# EAGLE design 1a (EAGLE 6.4)
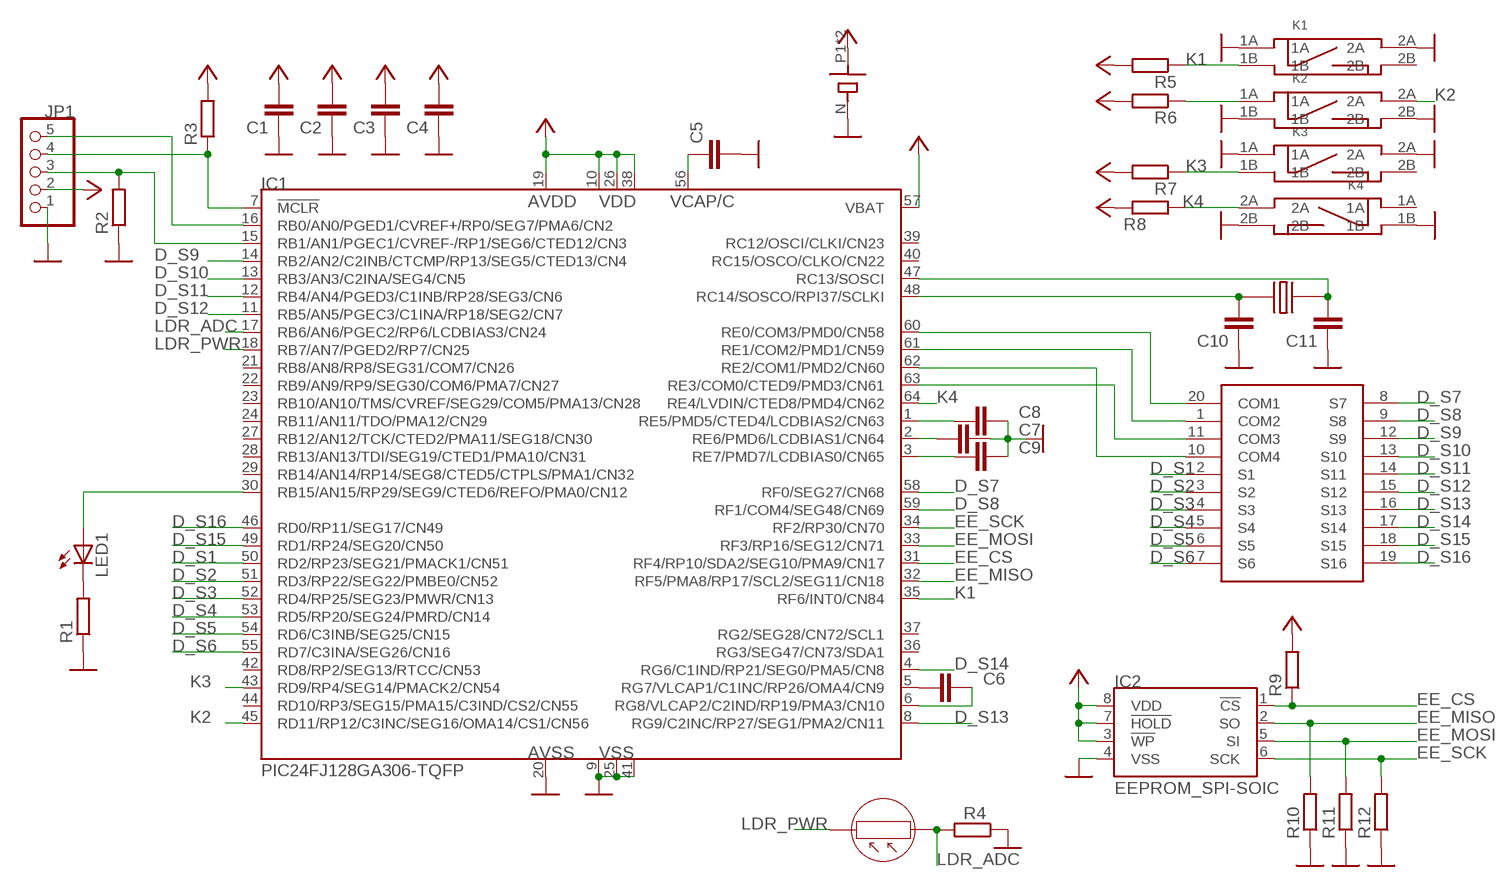
[diagram p0: schematic, sheet 1]

## Parts
C1  C_1206  [R1206]
C2  C_0603  [0603]
C3  C_0603  [0603]
C4  C_0603  [0603]
C5  C_0603  [0603]
C6  C_0603  [0603]
C7  C_0603  [0603]
C8  C_0603  [0603]
C9  C_0603  [0603]
C10  C_0603  [0603]
C11  C_0603  [0603]
IC1  PIC24FJ128GA306-TQFP  [TQFP64-10X10]
IC2  EEPROM_SPI-SOIC  [SO-08]
JP1  PINHD-1X05_2.00  [1X05M]
K1  SWITCH_BD_B  [SW_SMD2]
K2  SWITCH_BD_B  [SW_SMD2]
K3  SWITCH_BD_B  [SW_SMD2]
K4  SWITCH_BD_B  [SW_SMD2]
LCD1  LCD_DE188  [LCD_DE188]
LDR1  LDR  [LDR_5]
LED1  LEDCHIPLED_0805  [CHIPLED_0805]
R1  R_0603  [0603]
R2  R_0603  [0603]
R3  R_0603  [0603]
R4  R_0603  [0603]
R5  R_0603  [0603]
R6  R_0603  [0603]
R7  R_0603  [0603]
R8  R_0603  [0603]
R9  R_0603  [0603]
R10  R_0603  [0603]
R11  R_0603  [0603]
R12  R_0603  [0603]
U$1  BATTK3002  [BATT_KEYS3002]
X1  CRYST_TC26MC146  [CRYST_MC146]

## Nets
D_S1: IC1.50(RD2/RP23/SEG21/PMACK1/CN51) LCD1.2(S1)
D_S2: IC1.51(RD3/RP22/SEG22/PMBE0/CN52) LCD1.3(S2)
D_S3: IC1.52(RD4/RP25/SEG23/PMWR/CN13) LCD1.4(S3)
D_S4: IC1.53(RD5/RP20/SEG24/PMRD/CN14) LCD1.5(S4)
D_S5: IC1.54(RD6/C3INB/SEG25/CN15) LCD1.6(S5)
D_S6: IC1.55(RD7/C3INA/SEG26/CN16) LCD1.7(S6)
D_S7: IC1.58(RF0/SEG27/CN68) LCD1.8(S7)
D_S8: IC1.59(RF1/COM4/SEG48/CN69) LCD1.9(S8)
D_S9: IC1.14(RB2/AN2/C2INB/CTCMP/RP13/SEG5/CTED13/CN4) LCD1.12(S9)
D_S10: IC1.13(RB3/AN3/C2INA/SEG4/CN5) LCD1.13(S10)
D_S11: IC1.12(RB4/AN4/PGED3/C1INB/RP28/SEG3/CN6) LCD1.14(S11)
D_S12: IC1.11(RB5/AN5/PGEC3/C1INA/RP18/SEG2/CN7) LCD1.15(S12)
D_S13: IC1.8(RG9/C2INC/RP27/SEG1/PMA2/CN11) LCD1.16(S13)
D_S14: IC1.4(RG6/C1IND/RP21/SEG0/PMA5/CN8) LCD1.17(S14)
D_S15: IC1.49(RD1/RP24/SEG20/CN50) LCD1.18(S15)
D_S16: IC1.46(RD0/RP11/SEG17/CN49) LCD1.19(S16)
EE_CS: IC1.31(RF4/RP10/SDA2/SEG10/PMA9/CN17) IC2.1(!CS) R9.1
EE_MISO: IC1.32(RF5/PMA8/RP17/SCL2/SEG11/CN18) IC2.2(SO) R10.2
EE_MOSI: IC1.33(RF3/RP16/SEG12/CN71) IC2.5(SI) R11.2
EE_SCK: IC1.34(RF2/RP30/CN70) IC2.6(SCK) R12.2
GND: C1.1 C2.1 C3.1 C4.1 C5.2 C7.1 C8.1 C9.1 C10.1 C11.1 IC1.9(VSS) IC1.20(AVSS) IC1.25(VSS) IC1.41(VSS) IC2.4(VSS) JP1.1 K1.1A K1.2A K2.1B K2.2B K3.1A K3.2A K4.1B K4.2B R1.1 R2.1 R4.1 R10.1 R11.1 R12.1 U$1.N(M)
K1: IC1.35(RF6/INT0/CN84) K1.1B R5.1
K2: IC1.45(RD11/RP12/C3INC/SEG16/OMA14/CS1/CN56) K2.2A
K3: IC1.43(RD9/RP4/SEG14/PMACK2/CN54) K3.1B R7.1
K4: IC1.64(RE4/LVDIN/CTED8/PMD4/CN62) K4.2A R8.2
LDR_ADC: IC1.17(RB6/AN6/PGEC2/RP6/LCDBIAS3/CN24) LDR1.P$1 R4.2
LDR_PWR: IC1.18(RB7/AN7/PGED2/RP7/CN25) LDR1.P$2
N$5: C5.1 IC1.56(C)
N$6: C11.2 IC1.47(RC13/SOSCI) X1.1
N$7: C10.2 IC1.48(RC14/SOSCO/RPI37/SCLKI) X1.4
N$8: IC1.60(RE0/COM3/PMD0/CN58) LCD1.20(COM1)
N$9: IC1.61(RE1/COM2/PMD1/CN59) LCD1.1(COM2)
N$10: IC1.63(RE3/COM0/CTED9/PMD3/CN61) LCD1.11(COM3)
N$11: IC1.62(RE2/COM1/PMD2/CN60) LCD1.10(COM4)
N$12: C8.2 IC1.1(RE5/PMD5/CTED4/LCDBIAS2/CN63)
N$13: C7.2 IC1.2(RE6/PMD6/LCDBIAS1/CN64)
N$14: C9.2 IC1.3(RE7/PMD7/LCDBIAS0/CN65)
N$15: LED1.C R1.2
N$16: IC1.30(RB15/AN15/RP29/SEG9/CTED6/REFO/PMA0/CN12) LED1.A
N$17: K2.1A R6.1
N$31: C6.2 IC1.5(RG7/VLCAP1/C1INC/RP26/OMA4/CN9)
N$32: C6.1 IC1.6(RG8/VLCAP2/C2IND/RP19/PMA3/CN10)
N$33: IC1.15(RB1/AN1/PGEC1/CVREF-/RP1/SEG6/CTED12/CN3) JP1.3 R2.2
N$34: IC1.16(RB0/AN0/PGED1/CVREF+/RP0/SEG7/PMA6/CN2) JP1.5
N$35: IC1.7(!MCLR) JP1.4 R3.1
VCC: C1.2 C2.2 C3.2 C4.2 IC1.10(VDD) IC1.19(AVDD) IC1.26(VDD) IC1.38(VDD) IC1.57(VBAT) IC2.3(!WP) IC2.7(!HOLD) IC2.8(VDD) JP1.2 R3.2 R5.2 R6.2 R7.2 R8.1 R9.2 U$1.P1(P) U$1.P2(P)
Unconnected: IC1.21(RB8/AN8/RP8/SEG31/COM7/CN26) IC1.22(RB9/AN9/RP9/SEG30/COM6/PMA7/CN27) IC1.23(RB10/AN10/TMS/CVREF/SEG29/COM5/PMA13/CN28) IC1.24(RB11/AN11/TDO/PMA12/CN29) IC1.27(RB12/AN12/TCK/CTED2/PMA11/SEG18/CN30) IC1.28(RB13/AN13/TDI/SEG19/CTED1/PMA10/CN31) IC1.29(RB14/AN14/RP14/SEG8/CTED5/CTPLS/PMA1/CN32) IC1.36(RG3/SEG47/CN73/SDA1) IC1.37(RG2/SEG28/CN72/SCL1) IC1.39(RC12/OSCI/CLKI/CN23) IC1.40(RC15/OSCO/CLKO/CN22) IC1.42(RD8/RP2/SEG13/RTCC/CN53) IC1.44(RD10/RP3/SEG15/PMA15/C3IND/CS2/CN55) K1.2B K3.2B K4.1A

## Library data of the parts
C1-C11 = _moja:C
IC1 = _mcom6:PIC24FJ128GA306
IC2 = _mcom6:EEPROM_SPI
JP1 = pinhead-2:PINHD-1X05: PIN HEADER
K1-K4 = _moja:SWITCH_BD
LCD1 = _moja:LCD_DE188
LDR1 = _moja:LDR
LED1 = led:LED: LED OSRAM: - CHIPLED LG R971, LG N971, LY N971, LG Q971, LY Q971, LO R971, LY R971 LH N974, LH R974 LS Q976, LO Q976, LY Q976 LO Q996 - Hyper CHIPLED LW Q18S LB Q993, LB Q99A, LB R99A - SideLED LS A670, LO A670, LY A670, LG A670, LP A670 LB A673, LV A673, LT A673, LW A673 LH A674 LY A675 LS A676, LA A676, LO A676, LY A676, LW A676 LS A679, LY A679, LG A679 - Hyper Micro SIDELED® LS Y876, LA Y876, LO Y876, LY Y876 LT Y87S - SmartLED LW L88C, LW L88S LB L89C, LB L89S, LG L890 LS L89K, LO L89K, LY L89K LS L896, LA L896, LO L896, LY L896 - TOPLED LS T670, LO T670, LY T670, LG T670, LP T670 LSG T670, LSP T670, LSY T670, LOP T670, LYG T670 LG T671, LOG T671, LSG T671 LB T673, LV T673, LT T673, LW T673 LH T674 LS T676, LA T676, LO T676, LY T676, LB T676, LH T676, LSB T676, LW T676 LB T67C, LV T67C, LT T67C, LS T67K, LO T67K, LY T67K, LW E67C LS E67B, LA E67B, LO E67B, LY E67B, LB E67C, LV E67C, LT E67C LW T67C LS T679, LY T679, LG T679 LS T770, LO T770, LY T770, LG T770, LP T770 LB T773, LV T773, LT T773, LW T773 LH T774 LS E675, LA E675, LY E675, LS T675 LS T776, LA T776, LO T776, LY T776, LB T776 LHGB T686 LT T68C, LB T68C - Hyper Mini TOPLED® LB M676 - Mini TOPLED Santana® LG M470 LS M47K, LO M47K, LY M47K Source: http://www.osram.convergy.de LUXEON: - LUMILED® LXK2-PW12-R00, LXK2-PW12-S00, LXK2-PW14-U00, LXK2-PW14-V00 LXK2-PM12-R00, LXK2-PM12-S00, LXK2-PM14-U00 LXK2-PE12-Q00, LXK2-PE12-R00, LXK2-PE12-S00, LXK2-PE14-T00, LXK2-PE14-U00 LXK2-PB12-K00, LXK2-PB12-L00, LXK2-PB12-M00, LXK2-PB14-N00, LXK2-PB14-P00, LXK2-PB14-Q00 LXK2-PR12-L00, LXK2-PR12-M00, LXK2-PR14-Q00, LXK2-PR14-R00 LXK2-PD12-Q00, LXK2-PD12-R00, LXK2-PD12-S00 LXK2-PH12-R00, LXK2-PH12-S00 LXK2-PL12-P00, LXK2-PL12-Q00, LXK2-PL12-R00 Source: www.luxeon.com KINGBRIGHT: KA-3528ASYC Source: www.kingbright.com
R1-R12 = _moja:R
U$1 = _moja:BATT
X1 = _moja:CRYST_TC26

## Board
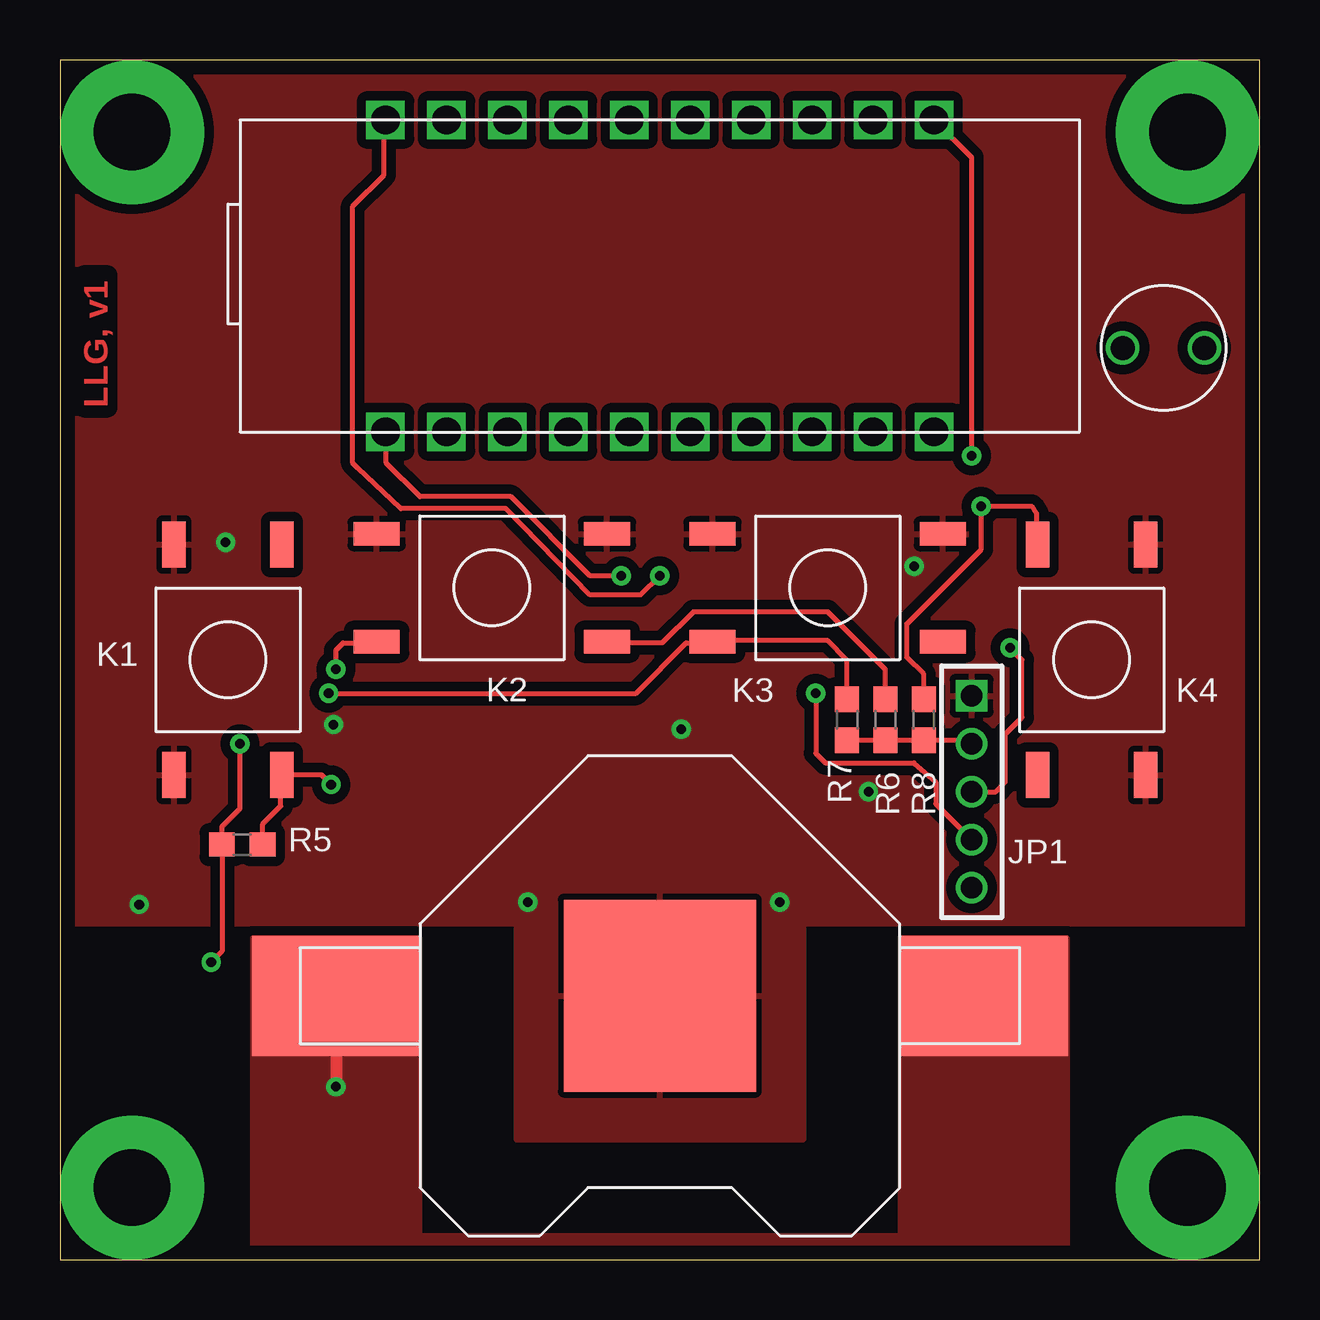
[diagram p1: board, top side]
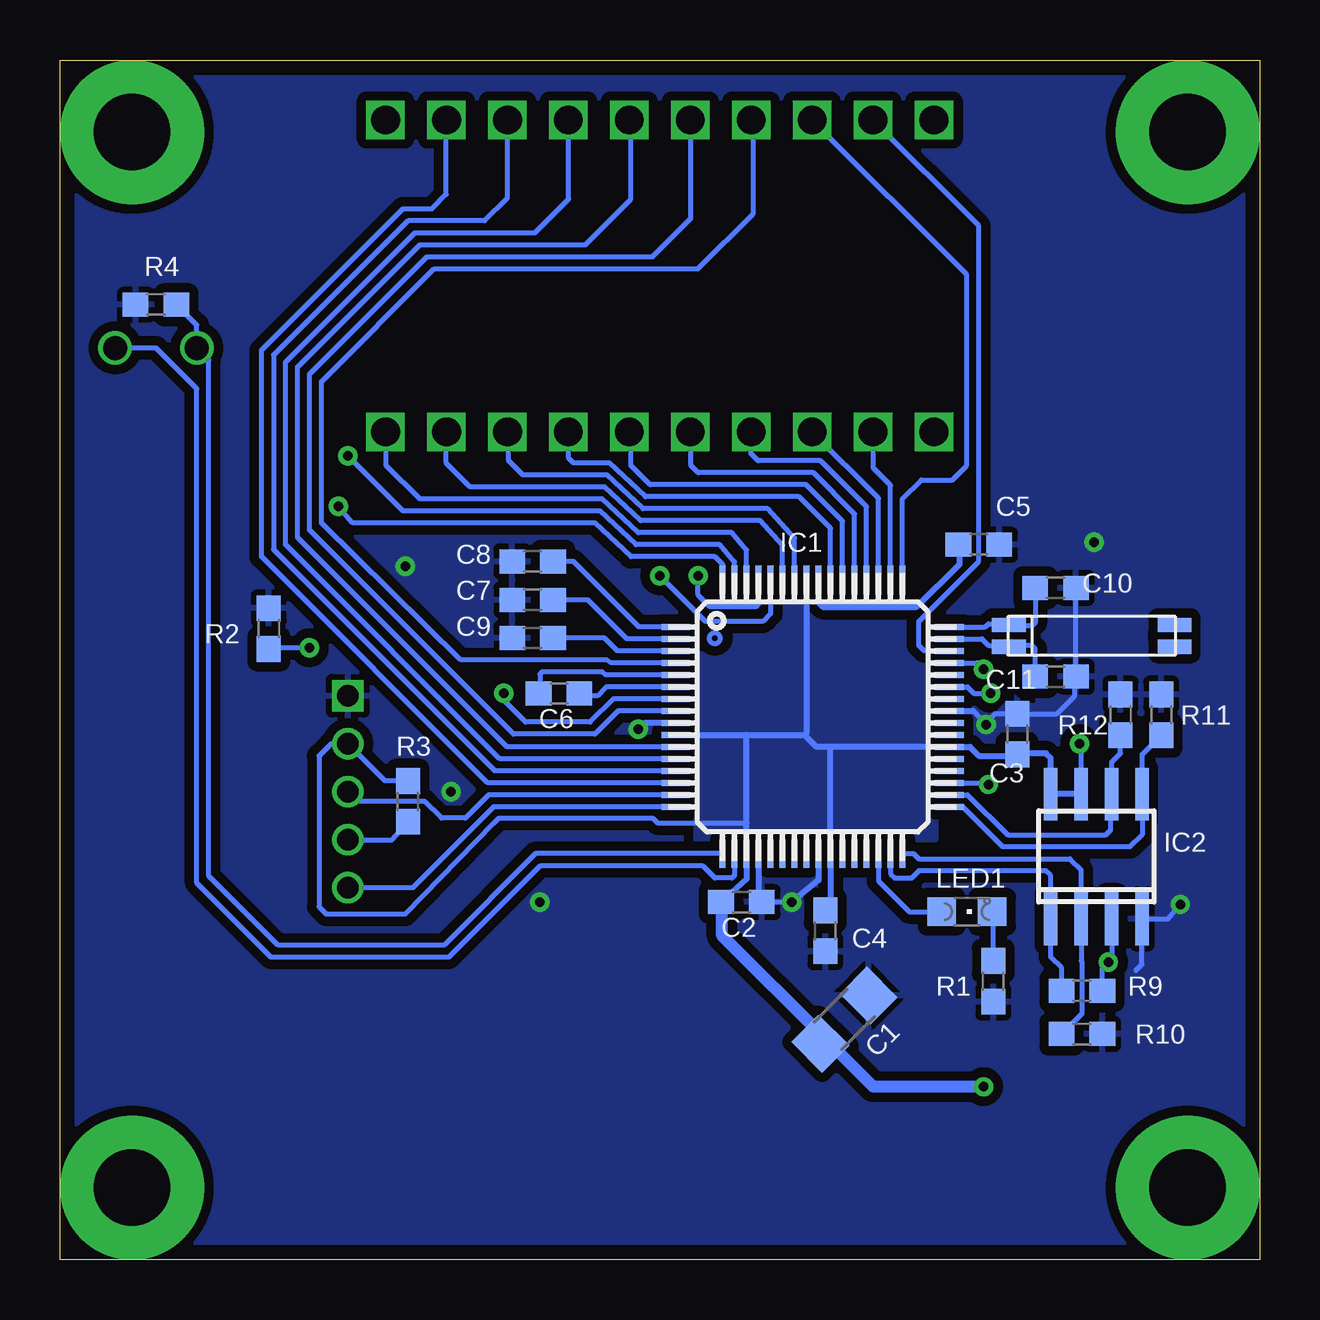
[diagram p2: board, bottom side, seen from below]

Size 50 x 50 mm. Coordinates in mm from the lower left corner, seen from the top.
Outline: 0,0 50,0 50,50 0,50 0,0
Copper layers (1*16): Top 0.035mm / dielectric 1.5mm / Bottom 0.035mm
Design rules "boris *": minimum track width 0.15mm, minimum drill 0.4mm, track to track 0.2mm, track to pad 0.2mm, pad to pad 0.2mm, via to via 0.2mm, smd to smd 0.2mm, copper to edge 0.6mm, drill to drill 8mil, minimum pad ring 0.2mm, minimum via ring 0.2mm, stop-mask expansion 4mil, vias tented up to drill 0mil, thermal gap 10mil

### Footprints (pad centres in the part's own frame; a part is rotated, then mirrored left to right if it is on the bottom)
R1206 = smd 1.6 x 1.803: 1 -1.422,0; 2 1.422,0
0603 = smd 1.067 x 1: 1 -0.85,0; 2 0.85,0
TQFP64-10X10 = smd 1.2 x 0.254: 1 -5.7,3.75; 2 -5.7,3.25; 3 -5.7,2.75; 4 -5.7,2.25; 5 -5.7,1.75; 6 -5.7,1.25; 7 -5.7,0.75; 8 -5.7,0.25; 9 -5.7,-0.25; 10 -5.7,-0.75; 11 -5.7,-1.25; 12 -5.7,-1.75; 13 -5.7,-2.25; 14 -5.7,-2.75; 15 -5.7,-3.25; 16 -5.7,-3.75; 33 5.7,-3.75; 34 5.7,-3.25; 35 5.7,-2.75; 36 5.7,-2.25; 37 5.7,-1.75; 38 5.7,-1.25; 39 5.7,-0.75; 40 5.7,-0.25; 41 5.7,0.25; 42 5.7,0.75; 43 5.7,1.25; 44 5.7,1.75; 45 5.7,2.25; 46 5.7,2.75; 47 5.7,3.25; 48 5.7,3.75 | smd 0.254 x 1.2: 17 -3.75,-5.7; 18 -3.25,-5.7; 19 -2.75,-5.7; 20 -2.25,-5.7; 21 -1.75,-5.7; 22 -1.25,-5.7; 23 -0.75,-5.7; 24 -0.25,-5.7; 25 0.25,-5.7; 26 0.75,-5.7; 27 1.25,-5.7; 28 1.75,-5.7; 29 2.25,-5.7; 30 2.75,-5.7; 31 3.25,-5.7; 32 3.75,-5.7; 49 3.75,5.7; 50 3.25,5.7; 51 2.75,5.7; 52 2.25,5.7; 53 1.75,5.7; 54 1.25,5.7; 55 0.75,5.7; 56 0.25,5.7; 57 -0.25,5.7; 58 -0.75,5.7; 59 -1.25,5.7; 60 -1.75,5.7; 61 -2.25,5.7; 62 -2.75,5.7; 63 -3.25,5.7; 64 -3.75,5.7
SO-08 = smd 0.55 x 2.2: 1 -1.905,-2.6; 2 -0.635,-2.6; 3 0.635,-2.6; 4 1.905,-2.6; 5 1.905,2.6; 6 0.635,2.6; 7 -0.635,2.6; 8 -1.905,2.6
1X05M = drill 0.914 square: 1 -4,0 | drill 0.914: 2 -2,0; 3 0,0; 4 2,0; 5 4,0
SW_SMD2 = smd 1.93 x 0.965: 1A -4.8,2.25; 1B -4.8,-2.25; 2A 4.8,2.25; 2B 4.8,-2.25
LCD_DE188 = drill 1.2 square: 1 -11.43,-6.5; 2 -8.89,-6.5; 3 -6.35,-6.5; 4 -3.81,-6.5; 5 -1.27,-6.5; 6 1.27,-6.5; 7 3.81,-6.5; 8 6.35,-6.5; 9 8.89,-6.5; 10 11.43,-6.5; 11 11.43,6.5; 12 8.89,6.5; 13 6.35,6.5; 14 3.81,6.5; 15 1.27,6.5; 16 -1.27,6.5; 17 -3.81,6.5; 18 -6.35,6.5; 19 -8.89,6.5; 20 -11.43,6.5
LDR_5 = drill 1: P$1 -1.7,0; P$2 1.7,0
CHIPLED_0805 = smd 1.2 x 1.2: A 0,-1.05; C 0,1.05
BATT_KEYS3002 = smd 8 x 8: N 0,0 | smd 7 x 5: P1 -13.5,0; P2 13.5,0
CRYST_MC146 = smd 1.4 x 0.6: 1 -3.45,-0.45; 2 3.45,-0.45; 3 3.45,0.45; 4 -3.45,0.45

### Placement (x,y rotation side)
C1  17.3,10 225 bottom
C2  21.6,14.9 180 bottom
C3  10.1,21.9 270 bottom
C4  18.1,13.7 90 bottom
C5  11.7,29.8 0 bottom
C6  29.2,23.6 180 bottom
C7  30.3,27.5 0 bottom
C8  30.3,29.1 0 bottom
C9  30.3,25.9 0 bottom
C10  8.5,28 180 bottom
C11  8.5,24.3 180 bottom
IC1  18.63,22.62 0 bottom
IC2  6.8,16.8 0 bottom
JP1  38,19.5 270 top
K1  7,25 90 top
K2  18,28 180 top
K3  32,28 0 top
K4  43,25 90 top
LCD1  25,41 0 top
LDR1  46,38 0 top
LED1  12.2,14.5 270 bottom
R1  11.1,11.6 90 bottom
R2  41.3,26.3 270 bottom
R3  35.5,19.1 90 bottom
R4  46,39.8 0 bottom
R5  7.6,17.3 180 top
R6  34.4,22.5 270 top
R7  32.8,22.5 270 top
R8  36,22.5 90 top
R9  7.4,11.2 0 bottom
R10  7.4,9.4 180 bottom
R11  4.1,22.7 270 bottom
R12  5.8,22.7 270 bottom
U$1  25,11 180 top
X1  7,26 0 bottom

### Tracks (layer width: path | path; a pad name or v marks a point on that pad's centre or on a via)
D_S1
  Bottom 0.2: IC1.50 15.38,32.28 16.1,33 LCD1.2
D_S2
  Bottom 0.2: IC1.51 15.88,31.73 LCD1.3
D_S3
  Bottom 0.2: IC1.52 16.38,31.38 18.3,33.3 20.9,33.3 21.2,33.6 LCD1.4
D_S4
  Bottom 0.2: IC1.53 16.88,31.08 18.6,32.8 23.4,32.8 23.7,33.1 23.7,34.47 LCD1.5
D_S5
  Bottom 0.2: IC1.54 17.38,30.78 18.9,32.3 25.4,32.3 26.2,33.1 26.2,34.43 LCD1.6
D_S6
  Bottom 0.2: IC1.55 17.88,30.48 19.2,31.8 25.6,31.8 27.1,33.2 28.6,33.2 28.8,33.4 LCD1.7
D_S7
  Bottom 0.2: IC1.58 19.38,30.08 20.5,31.3 25.7,31.3 27.2,32.7 30.7,32.7 31.3,33.3 31.3,34.4 | 31.3,34.4 31.3,34.45 | LCD1.8 31.35,34.45 31.3,34.4
D_S8
  Bottom 0.2: IC1.59 19.88,29.78 20.8,30.8 25.8,30.8 27.3,32.2 32.9,32.2 33.9,33.2 LCD1.9
D_S9
  Bottom 0.2: IC1.14 32.17,19.87 41.6,29.3 41.6,37.9 35.7,43.8 34.5,43.8 33.9,44.4 LCD1.12
D_S10
  Bottom 0.2: IC1.13 31.87,20.37 41.1,29.6 41.1,37.7 35.5,43.3 32.3,43.3 31.35,44.25 LCD1.13
D_S11
  Bottom 0.2: IC1.12 31.67,20.87 40.6,29.8 40.6,37.4 35.2,42.8 30.2,42.8 28.8,44.2 28.8,47.4 | 28.8,47.4 LCD1.14 | LCD1.14 28.81,47.41 28.8,47.4
D_S12
  Bottom 0.2: IC1.11 31.37,21.37 40.1,30.1 40.1,37.2 35,42.3 28.1,42.3 26.2,44.2 26.2,47.43 LCD1.15
D_S13
  Bottom 0.2: IC1.8 26.73,22.87 27.7,21.9 31.1,21.9 39.6,30.4 39.6,36.9 34.7,41.8 25.3,41.8 23.7,43.4 23.7,47.47 LCD1.16
D_S14
  Bottom 0.2: IC1.4 27.03,24.87 27.2,25 33.3,25 39.1,30.7 39.1,36.6 34.4,41.3 23.4,41.3 21.1,43.6 21.1,47.41 LCD1.17
D_S15
  Bottom 0.2: IC1.49 14.88,31.72 14.1,32.5 12.8,32.5 12.2,33.1 12.2,41.05 LCD1.18
D_S16
  Bottom 0.2: IC1.46 13.97,25.37 14.2,25.6 14.2,26.6 11.7,29.1 11.7,43.09 LCD1.19
EE_CS
  Bottom 0.2: IC1.31 15.38,16.08 15.2,15.9 14.5,15.9 14.2,16.2 8.9,16.2 8.71,16 IC2.1 8.7,12.6 8.25,12.15 R9.1
EE_MISO
  Bottom 0.2: IC1.32 14.42,16.92 14.2,16.7 7.9,16.7 7.43,16.23 IC2.2 7.43,12.44 7.4,12.4 7.4,10.25 R10.2
EE_MOSI
  Bottom 0.2: IC1.33 12.37,18.87 10.7,17.2 5.4,17.2 4.89,17.7 IC2.5 4.89,21.05 R11.2
EE_SCK
  Bottom 0.2: IC1.34 12.17,19.37 10.5,17.7 6.4,17.7 6.2,17.9 6.2,19.36 IC2.6 6.17,20.73 5.8,21.1 R12.2
GND  (via drill 0.4)
  Top 0.2: v19.5,14.9 19.6,15 | v3.3,14.8 3.5,15
  Bottom 0.2: 11.93,22.87 v11.4,22.3 11.05,22.75 C3.1 8.45,22.75 7.7,23.5 7.7,24.25 C11.1 C10.1 | 20.88,15.43 C2.1 v19.5,14.9 | v3.3,14.8 3.8,14.2 IC2.4 4.9,12.3 5.15,12.05
  Bottom 0.25: IC1.41 11.93,22.87 | IC1.25 18.38,15.82 v19.5,14.9 | IC1.20 20.88,15.43 | IC1.9 25.63,22.37 v25.9,22.1
  other vias: 35.6,28.9 30,14.9 6.9,29.9 33.7,19.5
  pour Top (isolate 0.4): 0,14 19,14 19,5 31,5 31,14 50,14 50,50 0,50
  pour Bottom (isolate 0.4, rank 2): 50,0 0,0 0,50 50,50
  pour Bottom (no thermals): 11,22.1 9.1,22.1 9.1,23.1 10.6,23.1 11,22.7
K1  (via drill 0.4)
  Top 0.2: R5.1 8.45,18.15 9.2,18.9 9.2,20.15 K1.1B 10.9,20.2 v11.3,19.8
  Bottom 0.2: IC1.35 11.27,19.87 v11.3,19.8
K2  (via drill 0.4)
  Top 0.2: v11.5,24.6 11.5,25.4 11.8,25.7 13.15,25.7 K2.2A
  Bottom 0.2: IC1.45 11.77,24.87 v11.5,24.6
K3  (via drill 0.4)
  Top 0.2: v11.2,23.6 24,23.6 26.1,25.7 27.15,25.7 K3.1B | 27.15,25.8 K3.1B | R7.1 32.8,25 32,25.8 27.25,25.8 K3.1B
  Bottom 0.2: IC1.43 12.17,23.87 11.9,23.6 v11.2,23.6
K4  (via drill 0.4)
  Top 0.2: K4.2A 40.7,29.85 40.7,31.1 40.5,31.4 v38.4,31.4 38.4,29.6 35.3,26.5 35.3,25.1 36,24.4 R8.2
  Bottom 0.2: IC1.64 22.38,28.98 22.7,29.3 26.2,29.3 27.7,30.7 37.8,30.7 v38.4,31.4
LDR_ADC
  Bottom 0.2: IC1.17 30.18,16.92 34,13.1 40.9,13.1 43.8,16 43.8,37.5 LDR1.P$1 44.3,38.95 R4.2
LDR_PWR
  Bottom 0.2: IC1.18 21.88,16.02 22,15.9 22.7,15.9 23.2,16.4 30,16.4 33.8,12.6 41.2,12.6 44.3,15.7 44.3,36.3 46,38 LDR1.P$2
N$1  (via drill 3.2 pad 6)
  other vias: 3,47
N$2  (via drill 3.2 pad 6)
  other vias: 47,47
N$3  (via drill 3.2 pad 6)
  other vias: 3,3
N$4  (via drill 3.2 pad 6)
  other vias: 47,3
N$5
  Bottom 0.2: 12.5,29.65 C5.1
  Bottom 0.25: IC1.56 18.38,27.38 18.2,27.2 14.3,27.2 12.5,29 12.5,29.65
N$6
  Bottom 0.2: IC1.47 11.57,25.87 11.3,25.6 10.5,25.6 X1.1 10.4,25.6 9.5,25.6 9.35,25.45 C11.2
N$7
  Bottom 0.2: IC1.48 11.43,26.37 11.3,26.5 10.5,26.5 X1.4 10.4,26.4 9.5,26.4 9.35,26.55 C10.2
N$8  (via drill 0.4)
  Top 0.2: v25,28.5 24.2,27.7 22.1,27.7 18.6,31.3 14.2,31.3 12.4,33 12.2,33.2 12.2,43.9 13.5,45.2 13.5,47.43 LCD1.20
  Bottom 0.2: IC1.60 20.38,26.92 20.7,26.6 23.1,26.6 v25,28.5
N$9  (via drill 0.4)
  Top 0.2: v23.4,28.5 22.1,28.5 18.8,31.8 15,31.8 13.6,33.2 13.6,34.47 LCD1.1
  Bottom 0.2: IC1.61 20.88,27.32 21,27.2 22.9,27.2 23.4,27.7 v23.4,28.5
N$10  (via drill 0.4)
  Top 0.2: v38,33.5 38,45.93 LCD1.11
  Bottom 0.2: IC1.63 21.88,29.08 22.5,29.8 26,29.8 27.5,31.2 35.7,31.2 v38,33.5
N$11
  Bottom 0.2: IC1.62 21.38,29.58 22,30.3 25.9,30.3 27.4,31.7 35,31.7 36.4,33.1 36.4,33.8 36.3,33.9 36.3,34.37 LCD1.10
N$12
  Bottom 0.2: IC1.1 25.87,26.37 28.6,29.1 C8.2
N$13
  Bottom 0.2: IC1.2 26.37,25.87 28,27.5 C7.2
N$14
  Bottom 0.2: IC1.3 26.77,25.37 27.3,25.9 C9.2
N$15
  Bottom 0.2: R1.2 11.1,14.45 LED1.C
N$16
  Bottom 0.2: IC1.30 15.88,15.78 14.6,14.5 LED1.A
N$17
  Top 0.2: R6.1 34.4,24.6 32,27 26.4,27 25.1,25.7 22.85,25.7 K2.1A
N$31
  Bottom 0.2: IC1.5 27.27,24.37 27.4,24.5 29.9,24.5 30,24.4 30,23.65 C6.2
N$32
  Bottom 0.2: IC1.6 27.23,23.87 27.6,23.5 28.05,23.5 C6.1
N$33  (via drill 0.4)
  Top 0.2: JP1.3 39,19.5 39.4,19.9 39.4,21.9 40.1,22.6 40.1,25 v39.6,25.5
  Bottom 0.2: IC1.15 32.13,19.37 33.1,18.4 34.1,18.4 34.8,19.1 37.5,19.1 JP1.3 | v39.6,25.5 41.25,25.5 R2.2
N$34
  Bottom 0.2: IC1.16 31.93,18.87 35.3,15.5 JP1.5
N$35  (via drill 0.4)
  Top 0.2: v31.5,23.6 31.5,21.1 31.9,20.7 35.6,20.7 36.5,19.9 36.5,19 JP1.4
  Bottom 0.2: JP1.4 36.15,17.5 R3.1 | IC1.7 26.93,23.37 27.9,22.4 30.6,22.4 31.5,23.3 v31.5,23.6
VCC  (via drill 0.4)
  Top 0.2: v6.3,12.4 6.75,12.85 R5.2 6.75,18.05 7.5,18.8 v7.5,21.5 | JP1.2 37.75,21.65 R8.1 R6.2 R7.2
  Top 0.5: U$1.P2 v11.5,7.2
  Bottom 0.2: 17.88,21.35 17.9,21.37 | 21.38,21.85 21.4,21.87 | 18.88,21.96 18.97,21.87 | R3.2 36.45,19.95 JP1.2 38.7,21.5 39.2,21 39.2,14.7 38.9,14.4 35.6,14.4 31.9,18.2 31.7,18.4 25.3,18.4 25.1,18.2 21.38,18.2 | 10.15,21 C3.2 10.05,21.1 | 22,14.85 C2.2 22.4,14.85 | IC2.7 7.43,21.43 v7.5,21.5 | R9.2 6.55,12.15 v6.3,12.4 6.17,12.54 IC2.3 | 17.88,15.03 C4.2 | C1.2 18.19,9.21 18.1,9.2
  Bottom 0.25: IC1.10 21.4,21.87 18.97,21.87 18.47,21.37 17.9,21.37 IC1.38 12.07,21.37 11.7,21 10.15,21 | 17.88,21.35 IC1.26 17.88,15.03 | 21.38,21.85 21.38,18.2 IC1.19 21.38,15.87 C2.2 | IC1.57 18.88,21.96 | 10.05,21.1 8.9,21.1 8.71,20.91 IC2.8 IC2.7
  Bottom 0.5: v11.5,7.2 16.1,7.2 18.1,9.2 22.4,13.5 22.4,14.85
  pour Bottom (isolate 0.4): 13.5,27.5 13.5,17.5 23.5,17.5 23.5,27.5
  pour Top (no thermals): 8,13.4 8,0 42,0 42,13.4 35,13.4 35,1 15,1 15,13.4
(copper drawn outside any net)
  shapes: Bottom circle x1

### Text on the board
Top: LLG, v1